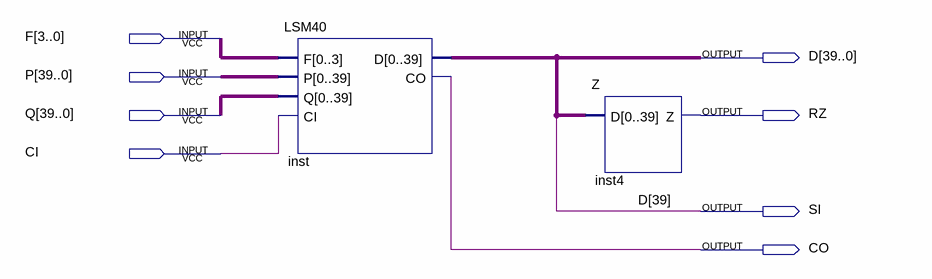
[diagram p0: schematic sheet]
// Quartus schematic Lab2.bdf as structural Verilog: 2 symbols, 8 pins
module Lab2 (
  input  [3:0] F,
  input  [39:0] P,
  input  [39:0] Q,
  input  CI,
  output [39:0] D,
  output RZ,
  output SI,
  output CO
);

  LSM40 inst (.F(F), .P(P), .Q(Q), .CI(CI), .D(D), .CO(CO));
  Z inst4 (.D(D), .Z(RZ));

  assign SI = D[39];
endmodule
